# Altium schematic sheet 02-CPU.SchDoc
size A4; SheetNumber: 2; SheetTotal: 4
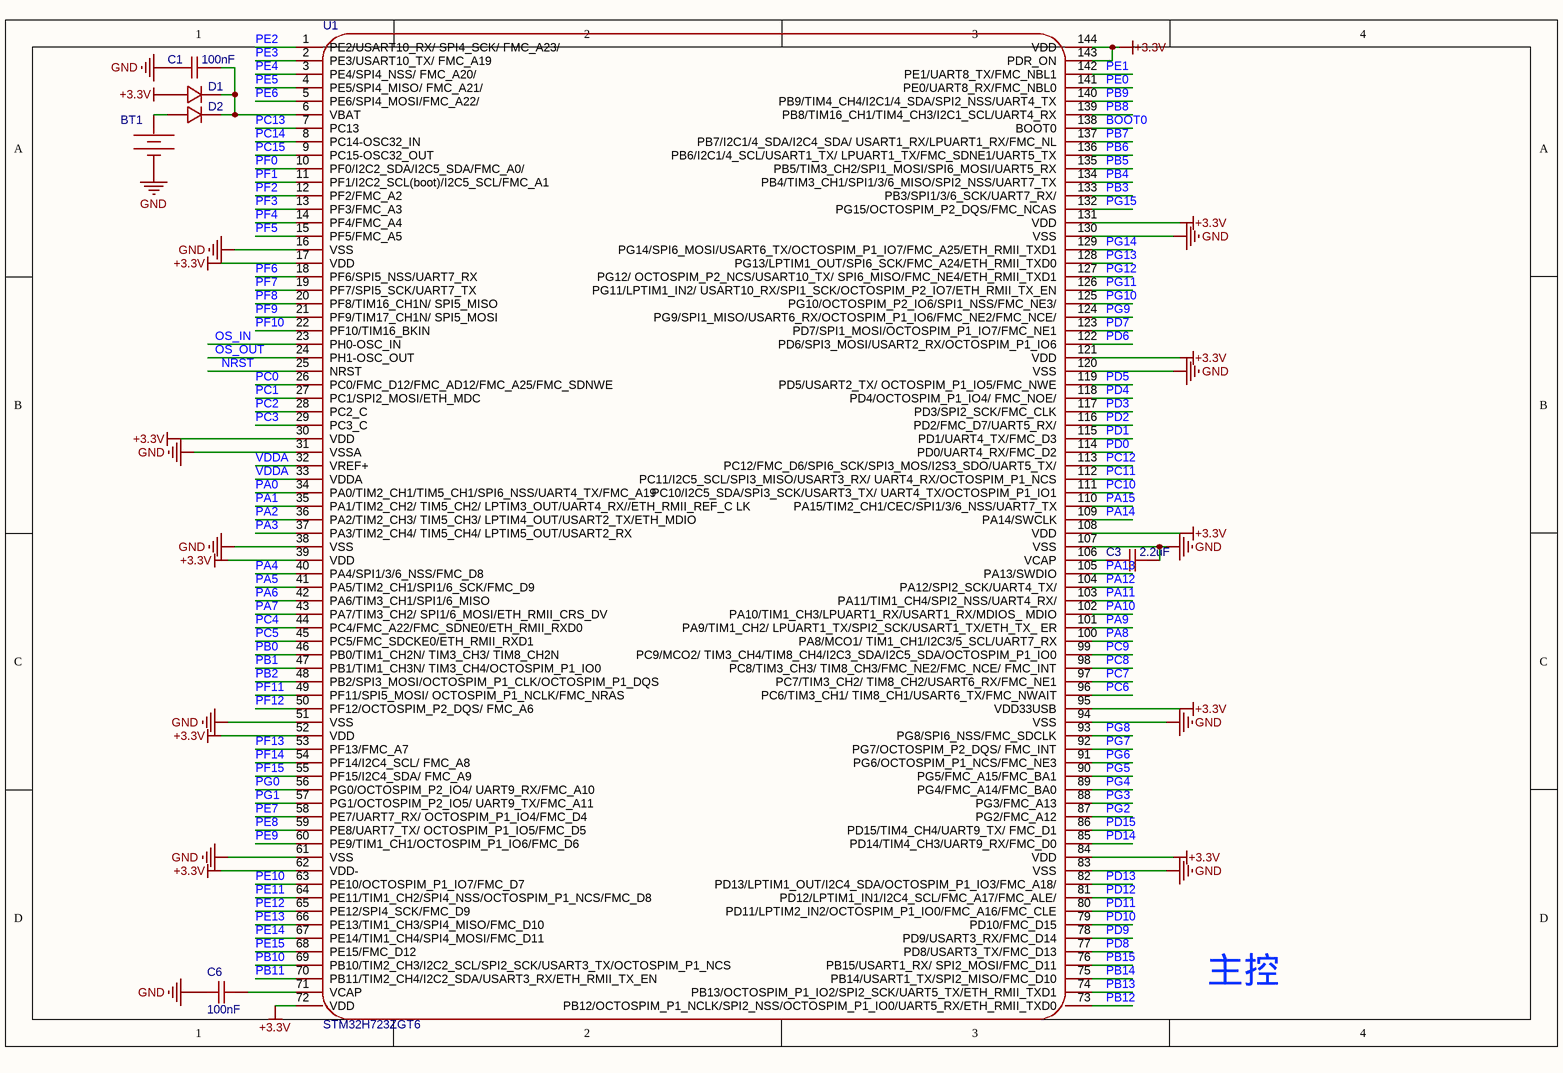
[diagram p0: 02-CPU.SchDoc]

## Parts
BT1  BS-12-B3AA003  [BAT-SMD_BS-12-B3AA011]  (value not drawn)
C1  value 100nF  [C0603]  (hidden comment: CAP_0603)
C3  value 2.2uF  [C0603]  (hidden comment: CAP_0603)
C6  value 100nF  [C0603]  (hidden comment: CAP_0603)
D1  LL4148_C9808  [LL-34_L3.5-W1.5-RD]  (value not drawn)
D2  LL4148_C9808  [LL-34_L3.5-W1.5-RD]  (value not drawn)
U1  STM32H723ZGT6  [LQFP-144_20.0X20.0X0.5P]

## Nets
+3.3V: D1.2(A) U1.17(VDD) U1.30(VDD) U1.39(VDD) U1.52(VDD) U1.62(VDD-) U1.72(VDD) U1.84(VDD) U1.95(VDD33USB) U1.108(VDD) U1.121(VDD) U1.131(VDD) U1.143(PDR_ON) U1.144(VDD)
GND: BT1.2(-) C1.2 C3.1 C6.1 U1.16(VSS) U1.31(VSSA) U1.38(VSS) U1.51(VSS) U1.61(VSS) U1.83(VSS) U1.94(VSS) U1.107(VSS) U1.120(VSS) U1.130(VSS)
BOOT0: U1.138(BOOT0)
NRST: U1.25(NRST)
OS_IN: U1.23(PH0-OSC_IN)
OS_OUT: U1.24(PH1-OSC_OUT)
PA0: U1.34(PA0/TIM2_CH1/TIM5_CH1/SPI6_NSS/UART4_TX/FMC_A19)
PA1: U1.35(PA1/TIM2_CH2/_TIM5_CH2/_LPTIM3_OUT/UART4_RX//ETH_RMII_REF_C_LK)
PA2: U1.36(PA2/TIM2_CH3/_TIM5_CH3/_LPTIM4_OUT/USART2_TX/ETH_MDIO)
PA3: U1.37(PA3/TIM2_CH4/_TIM5_CH4/_LPTIM5_OUT/USART2_RX)
PA4: U1.40(PA4/SPI1/3/6_NSS/FMC_D8)
PA5: U1.41(PA5/TIM2_CH1/SPI1/6_SCK/FMC_D9)
PA6: U1.42(PA6/TIM3_CH1/SPI1/6_MISO)
PA7: U1.43(PA7/TIM3_CH2/_SPI1/6_MOSI/ETH_RMII_CRS_DV)
PA8: U1.100(PA8/MCO1/_TIM1_CH1/I2C3/5_SCL/UART7_RX)
PA9: U1.101(PA9/TIM1_CH2/_LPUART1_TX/SPI2_SCK/USART1_TX/ETH_TX__ER)
PA10: U1.102(PA10/TIM1_CH3/LPUART1_RX/USART1_RX/MDIOS__MDIO)
PA11: U1.103(PA11/TIM1_CH4/SPI2_NSS/UART4_RX/)
PA12: U1.104(PA12/SPI2_SCK/UART4_TX/)
PA13: U1.105(PA13/SWDIO)
PA14: U1.109(PA14/SWCLK)
PA15: U1.110(PA15/TIM2_CH1/CEC/SPI1/3/6_NSS/UART7_TX)
PB0: U1.46(PB0/TIM1_CH2N/_TIM3_CH3/_TIM8_CH2N)
PB1: U1.47(PB1/TIM1_CH3N/_TIM3_CH4/OCTOSPIM_P1_IO0)
PB2: U1.48(PB2/SPI3_MOSI/OCTOSPIM_P1_CLK/OCTOSPIM_P1_DQS)
PB3: U1.133(PB3/SPI1/3/6_SCK/UART7_RX/)
PB4: U1.134(PB4/TIM3_CH1/SPI1/3/6_MISO/SPI2_NSS/UART7_TX)
PB5: U1.135(PB5/TIM3_CH2/SPI1_MOSI/SPI6_MOSI/UART5_RX)
PB6: U1.136(PB6/I2C1/4_SCL/USART1_TX/_LPUART1_TX/FMC_SDNE1/UART5_TX)
PB7: U1.137(PB7/I2C1/4_SDA/I2C4_SDA/_USART1_RX/LPUART1_RX/FMC_NL)
PB8: U1.139(PB8/TIM16_CH1/TIM4_CH3/I2C1_SCL/UART4_RX)
PB9: U1.140(PB9/TIM4_CH4/I2C1/4_SDA/SPI2_NSS/UART4_TX)
PB10: U1.69(PB10/TIM2_CH3/I2C2_SCL/SPI2_SCK/USART3_TX/OCTOSPIM_P1_NCS)
PB11: U1.70(PB11/TIM2_CH4/I2C2_SDA/USART3_RX/ETH_RMII_TX_EN)
PB12: U1.73(PB12/OCTOSPIM_P1_NCLK/SPI2_NSS/OCTOSPIM_P1_IO0/UART5_RX/ETH_RMII_TXD0)
PB13: U1.74(PB13/OCTOSPIM_P1_IO2/SPI2_SCK/UART5_TX/ETH_RMII_TXD1)
PB14: U1.75(PB14/USART1_TX/SPI2_MISO/FMC_D10)
PB15: U1.76(PB15/USART1_RX/_SPI2_MOSI/FMC_D11)
PC0: U1.26(PC0/FMC_D12/FMC_AD12/FMC_A25/FMC_SDNWE)
PC1: U1.27(PC1/SPI2_MOSI/ETH_MDC)
PC2: U1.28(PC2_C)
PC3: U1.29(PC3_C)
PC4: U1.44(PC4/FMC_A22/FMC_SDNE0/ETH_RMII_RXD0)
PC5: U1.45(PC5/FMC_SDCKE0/ETH_RMII_RXD1)
PC6: U1.96(PC6/TIM3_CH1/_TIM8_CH1/USART6_TX/FMC_NWAIT)
PC7: U1.97(PC7/TIM3_CH2/_TIM8_CH2/USART6_RX/FMC_NE1)
PC8: U1.98(PC8/TIM3_CH3/_TIM8_CH3/FMC_NE2/FMC_NCE/_FMC_INT)
PC9: U1.99(PC9/MCO2/_TIM3_CH4/TIM8_CH4/I2C3_SDA/I2C5_SDA/OCTOSPIM_P1_IO0)
PC10: U1.111(PC10/I2C5_SDA/SPI3_SCK/USART3_TX/_UART4_TX/OCTOSPIM_P1_IO1)
PC11: U1.112(PC11/I2C5_SCL/SPI3_MISO/USART3_RX/_UART4_RX/OCTOSPIM_P1_NCS)
PC12: U1.113(PC12/FMC_D6/SPI6_SCK/SPI3_MOS/I2S3_SDO/UART5_TX/)
PC13: U1.7(PC13)
PC14: U1.8(PC14-OSC32_IN)
PC15: U1.9(PC15-OSC32_OUT)
PD0: U1.114(PD0/UART4_RX/FMC_D2)
PD1: U1.115(PD1/UART4_TX/FMC_D3)
PD2: U1.116(PD2/FMC_D7/UART5_RX/)
PD3: U1.117(PD3/SPI2_SCK/FMC_CLK)
PD4: U1.118(PD4/OCTOSPIM_P1_IO4/_FMC_NOE/)
PD5: U1.119(PD5/USART2_TX/_OCTOSPIM_P1_IO5/FMC_NWE)
PD6: U1.122(PD6/SPI3_MOSI/USART2_RX/OCTOSPIM_P1_IO6)
PD7: U1.123(PD7/SPI1_MOSI/OCTOSPIM_P1_IO7/FMC_NE1)
PD8: U1.77(PD8/USART3_TX/FMC_D13)
PD9: U1.78(PD9/USART3_RX/FMC_D14)
PD10: U1.79(PD10/FMC_D15)
PD11: U1.80(PD11/LPTIM2_IN2/OCTOSPIM_P1_IO0/FMC_A16/FMC_CLE)
PD12: U1.81(PD12/LPTIM1_IN1/I2C4_SCL/FMC_A17/FMC_ALE/)
PD13: U1.82(PD13/LPTIM1_OUT/I2C4_SDA/OCTOSPIM_P1_IO3/FMC_A18/)
PD14: U1.85(PD14/TIM4_CH3/UART9_RX/FMC_D0)
PD15: U1.86(PD15/TIM4_CH4/UART9_TX/_FMC_D1)
PE0: U1.141(PE0/UART8_RX/FMC_NBL0)
PE1: U1.142(PE1/UART8_TX/FMC_NBL1)
PE2: U1.1(PE2/USART10_RX/_SPI4_SCK/_FMC_A23/)
PE3: U1.2(PE3/USART10_TX/_FMC_A19)
PE4: U1.3(PE4/SPI4_NSS/_FMC_A20/)
PE5: U1.4(PE5/SPI4_MISO/_FMC_A21/)
PE6: U1.5(PE6/SPI4_MOSI/FMC_A22/)
PE7: U1.58(PE7/UART7_RX/_OCTOSPIM_P1_IO4/FMC_D4)
PE8: U1.59(PE8/UART7_TX/_OCTOSPIM_P1_IO5/FMC_D5)
PE9: U1.60(PE9/TIM1_CH1/OCTOSPIM_P1_IO6/FMC_D6)
PE10: U1.63(PE10/OCTOSPIM_P1_IO7/FMC_D7)
PE11: U1.64(PE11/TIM1_CH2/SPI4_NSS/OCTOSPIM_P1_NCS/FMC_D8)
PE12: U1.65(PE12/SPI4_SCK/FMC_D9)
PE13: U1.66(PE13/TIM1_CH3/SPI4_MISO/FMC_D10)
PE14: U1.67(PE14/TIM1_CH4/SPI4_MOSI/FMC_D11)
PE15: U1.68(PE15/FMC_D12)
PF0: U1.10(PF0/I2C2_SDA/I2C5_SDA/FMC_A0/)
PF1: U1.11(PF1/I2C2_SCL(boot)/I2C5_SCL/FMC_A1)
PF2: U1.12(PF2/FMC_A2)
PF3: U1.13(PF3/FMC_A3)
PF4: U1.14(PF4/FMC_A4)
PF5: U1.15(PF5/FMC_A5)
PF6: U1.18(PF6/SPI5_NSS/UART7_RX)
PF7: U1.19(PF7/SPI5_SCK/UART7_TX)
PF8: U1.20(PF8/TIM16_CH1N/_SPI5_MISO)
PF9: U1.21(PF9/TIM17_CH1N/_SPI5_MOSI)
PF10: U1.22(PF10/TIM16_BKIN)
PF11: U1.49(PF11/SPI5_MOSI/_OCTOSPIM_P1_NCLK/FMC_NRAS)
PF12: U1.50(PF12/OCTOSPIM_P2_DQS/_FMC_A6)
PF13: U1.53(PF13/FMC_A7)
PF14: U1.54(PF14/I2C4_SCL/_FMC_A8)
PF15: U1.55(PF15/I2C4_SDA/_FMC_A9)
PG0: U1.56(PG0/OCTOSPIM_P2_IO4/_UART9_RX/FMC_A10)
PG1: U1.57(PG1/OCTOSPIM_P2_IO5/_UART9_TX/FMC_A11)
PG2: U1.87(PG2/FMC_A12)
PG3: U1.88(PG3/FMC_A13)
PG4: U1.89(PG4/FMC_A14/FMC_BA0)
PG5: U1.90(PG5/FMC_A15/FMC_BA1)
PG6: U1.91(PG6/OCTOSPIM_P1_NCS/FMC_NE3)
PG7: U1.92(PG7/OCTOSPIM_P2_DQS/_FMC_INT)
PG8: U1.93(PG8/SPI6_NSS/FMC_SDCLK)
PG9: U1.124(PG9/SPI1_MISO/USART6_RX/OCTOSPIM_P1_IO6/FMC_NE2/FMC_NCE/)
PG10: U1.125(PG10/OCTOSPIM_P2_IO6/SPI1_NSS/FMC_NE3/)
PG11: U1.126(PG11/LPTIM1_IN2/_USART10_RX/SPI1_SCK/OCTOSPIM_P2_IO7/ETH_RMII_TX_EN)
PG12: U1.127(PG12/_OCTOSPIM_P2_NCS/USART10_TX/_SPI6_MISO/FMC_NE4/ETH_RMII_TXD1)
PG13: U1.128(PG13/LPTIM1_OUT/SPI6_SCK/FMC_A24/ETH_RMII_TXD0)
PG14: U1.129(PG14/SPI6_MOSI/USART6_TX/OCTOSPIM_P1_IO7/FMC_A25/ETH_RMII_TXD1)
PG15: U1.132(PG15/OCTOSPIM_P2_DQS/FMC_NCAS)
VDDA: U1.32(VREF+) U1.33(VDDA)
NetBT1_1: BT1.1(+) D2.2(A)
NetC1_1: C1.1 D1.1(K) D2.1(K) U1.6(VBAT)
NetC3_2: C3.2 U1.106(VCAP)
NetC6_2: C6.2 U1.71(VCAP)

## Notes on the sheet
- 主控

## Library data of the parts
BT1 = BS-12-B3AA003: 连接器类型:电池底座;适用电池规格:CR1220;工作温度范围:-25℃~+85℃;; Manufacturer: MYOUNG(美阳); AddInBom: yes; ModelId: 54ee14fdfc2a4013838c0af10e1f0cfd; ModelTransform: 732.282,586.427,0,0,0,0,-13.041,-1.024,-27.559; Connector Type: 电池底座; Battery Type: CR1220; Symbol: BS-12-B3AA003; Device: BS-12-B3AA003; Supplier: LCSC; Supplier Part: C964723; Manufacturer Part: BS-12-B3AA003; JLCPCB Part Class: 扩展库; LCSC Part Name: 电池底座 适用电池:CR1220; Supplier Footprint: SMD; Datasheet: https://atta.szlcsc.com/upload/public/pdf/source/20201218/C964723_733B638E287393F86295A2A4DAE43C75.pdf; ConvertToPcb: yes; FootprintName: BAT-SMD_BS-12-B3AA011; ModelName: BAT-SMD_BS-12-B3AA011; Operating Temperature Range: -25℃~+85℃
C1 C3 C6 = CAP_0603: ConvertToPcb: yes; SymbolName: CapAcitance; ModelId: ac125912035d415993ca9572d50418b1; ModelName: C0603_L1.6-W0.8-H0.8; ModelTransform: 62.992,31.496,0,0,0,0,0,0,0; Device: CAP_0603; AddInBom: yes; Supplier Footprint: 0603; FootprintName: C0603
D1 D2 = LL4148_C9808: 二极管配置:-;功率:500mW;直流反向耐压(Vr):75V;平均整流电流(Io):200mA;正向压降(Vf):1V@10mA;反向电流(Ir):5uA@75V;反向恢复时间(trr):4ns;工作温度:+175℃@(Tj);; Manufacturer: ST(先科); Symbol: LL4148; AddInBom: yes; ModelId: 4a6f2309ca4c4217857da1816cccdf69; ModelName: LL-34_L3.5-W1.5; ModelTransform: 133.93674,59.031,0,0,0,0,0,0,0; Power Dissipation: 500mW; Reverse Voltage (Vr): 75V; Average Rectified Current (Io): 200mA; Reverse Recovery Time (trr): 4ns; Device: LL4148_C9808; LCSC Part Name: 75V 200mA 4ns; SupplierPart: C9808; ManufacturerPart: LL4148; Supplier Footprint: LL-34; JLCPCB Part Class: Basic Part; Datasheet: https://atta.szlcsc.com/upload/public/pdf/source/20121108/1457706554347.pdf; Supplier: LCSC; ConvertToPcb: yes; FootprintName: LL-34_L3.5-W1.5-RD; Diode Configuration: -; Forward Voltage (Vf@If): 1V@10mA; Reverse Leakage Current: 5uA@75V; Operating Temperature: +175℃@(Tj)
U1 = STM32H723ZGT6: ARM-M系列 CPU最大主频：550MHz 程序存储容量：1MB 程序存储器类型：FLASH RAM总容量：564KB GPIO端口数量：80; AddInBom: yes; ModelId: 0b7bdfea88404874aa6fca7709e1f022; ModelTransform: 866.14,866.14,0,0,0,0,0,0,0; Device: STM32H723ZGT6; ConvertToPcb: yes; SymbolName: STM32H723ZGT6; FootprintName: LQFP-144_20.0X20.0X0.5P; ModelName: LQFP-144_20.0X20.0X0.5P